# Altium schematic sheet crystals.SchDoc
size A3; DocumentNumber: 8; SheetNumber: 8; SheetTotal: 24; SheetDescription: Crystals for MCU0
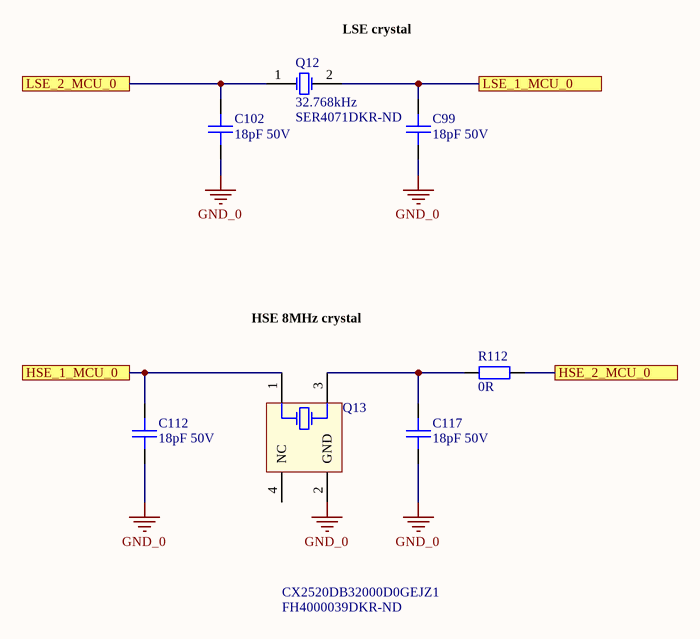
[diagram p0: crystals.SchDoc]

## Parts
C99  18pF 50V  [0402C]
C102  18pF 50V  [0402C]
C112  18pF 50V  [0402C]
C117  18pF 50V  [0402C]
Q12  32.768kHz  Supplier Part Number 1: SER4071DKR-ND  [ESPO-FC-135-2_V]
Q13  CX2520DB32000D0GEJZ1  Supplier Part Number 1: FH4000039DKR-ND  [AVX-CX2520DB32000D0GEJZ1-4_V]
R112  0R  [0402R]

## Ports
HSE_1_MCU_0, HSE_2_MCU_0, LSE_1_MCU_0, LSE_2_MCU_0

## Nets
GND_0: C99.1 C102.2 C112.1 C117.2 Q13.2(GND)
HSE_1_MCU_0: C112.2 Q13.1(HOT) ; port HSE_1_MCU_0
HSE_2_MCU_0: R112.1 ; port HSE_2_MCU_0
LSE_1_MCU_0: C99.2 Q12.2(X2) ; port LSE_1_MCU_0
LSE_2_MCU_0: C102.1 Q12.1(X1) ; port LSE_2_MCU_0
NetC117_1: C117.1 Q13.3(HOT) R112.2

Not connected (* = marked no-connect by the designer): Q13 4(NC)

## Notes on the sheet
- (near Q12) LSE crystal
- HSE 8MHz crystal
- Fraunhofer IISB
- Schottkystr. 10
- developed by:
- 91058 Erlangen
- Germany
- Author
- Project
- License
- Description
- File
- Version
- Release Date
- Sheet
- www.foxbms.org
- www.iisb.fraunhofer.de
- foxBMS Team
- /

## Library data of the parts
C99 C102 C112 C117 = gen_C_ceramic_18p_50V_C0G_0402: Ceramic, 18pF, ±5%, 50V, X7R, 25 to 125°C, 0402 (1005),RoHS, Automotive; Part Number: GCM1555C1H180JA16#; Manufacturer: Murata; Capacitance: 18p; Dielectric: C0G; Case EIA: 0402; Case Metric: 1005; Automotive Qualified: True; PnP Package: C_0402_10; PnP Value: 18pF/50V/X7R; Rated Voltage: 50V; Supplier 1: Digi-Key; Supplier Part Number 1: 490-12650-1-ND; Height - Seated (Max): 0.5mm; Mounting Type: SurfaceMount,MLCC; Operating Temperature: 25 to 125°C; Series: GCM; Tolerance: ±5%; Manufacturer_Part_Number: GCM1555C1H180JA16#
Q12 = CMP-2000-05107-1: Crystal, 32.768 KHz, 12.5 pF, -40 to 85 degC, 2-Pin SMD, RoHS, Tape and Reel; Manufacturer: Epson; Load Capacitance: 12.5pF; Frequency Stability: 20PPM; Drive Level: 0.5uW; Type: kHzCrystal; Unit Weight: 0.000564oz; Brand: EpsonTiming; ESR: 65kOhms; Series: FC-135R/FC-135/FC-255; Height: 0.8mm; Operating Temperature Range: -40Cto+85C; Package / Case: 3.2mmx1.5mm; Factory Pack Quantity: 250; Product Category: Crystals; Frequency: 32.768kHz; Package Description: 2-Pin Surface Mount Device, Body 3.2 x 1.5 mm; Width: 1.5mm; RoHS: True; Manufacturer URL: https://www.eea.epson.com/; Package Reference: FC-135; Datasheet Version: Nov-12; Tolerance: 20PPM; Mounting Style: SMD/SMT; Length: 3.2mm; Termination Style: SMD/SMT; Packaging: Reel; Datasheet URL: https://datasheet.ciiva.com/15116/getdatasheetpartid-112713-15116373.pdf; Supplier 1: Digi-Key
Q13 = CMP-0449-00001-1: Crystal,CRYSTAL 40MHZ 15PF 85degC Surface Mount 2.5 x 2.0 mm; Manufacturer: Kyocera; Drive Level: 10uW (100uW max.); Motional Series Resistance: 50 ohm (max); Frequency Range: 32000 kHz; Load Capacitance: 8 pF; Packing: Tape and Reel; ComponentLink2URL: http://global.kyocera.com/prdct/electro/pdf/xtal/cx2520db_cs_e.pdf; ComponentLink1Description: Manufacturer URL; PackageDescription: 4-Pin Hand Drawnï¼ŒBody 2.5x2mm; ComponentLink1URL: http://global.kyocera.com/; ComponentLink3URL: http://global.kyocera.com/prdct/electro/pdf/xtal/cx2520db_cs_e.pdf; ComponentLink2Description: Datasheet; PackageReference: CX2520DB32000D0GEJZ1-4; Operating Temperature: -10 to 70 degC; PartNumber: CX2520DB32000D0GEJZ1; ComponentLink3Description: Package Specification; Mounting Technology: Surface Mount; Supplier 1: Digi-Key
R112 = gen_R_0R_0402: SMD Resistor 0R 0402; Case EIA: 0402; Case Metric: 1005; PnP Package: R_0402; Automotive Qualified: False; Part Number: gen_R_0R_0402; PnP Value: 0R; Operating Temperature: -55°C - +155°C